# Altium schematic sheet BLOCK DIAGRAM.SchDoc: BLOCK DIAGRAM
size 420 x 297 mm; Date: March 14; CheckedBy: ThS. Bùi Quốc Bảo; DrawnBy: Nguyễn Gia Huy; Revision: V1.0; SheetNumber: 3; SheetTotal: 5; MasterProject: 2LEDs Dice game; Sub-system: 2LED_Dice.PrjPcb
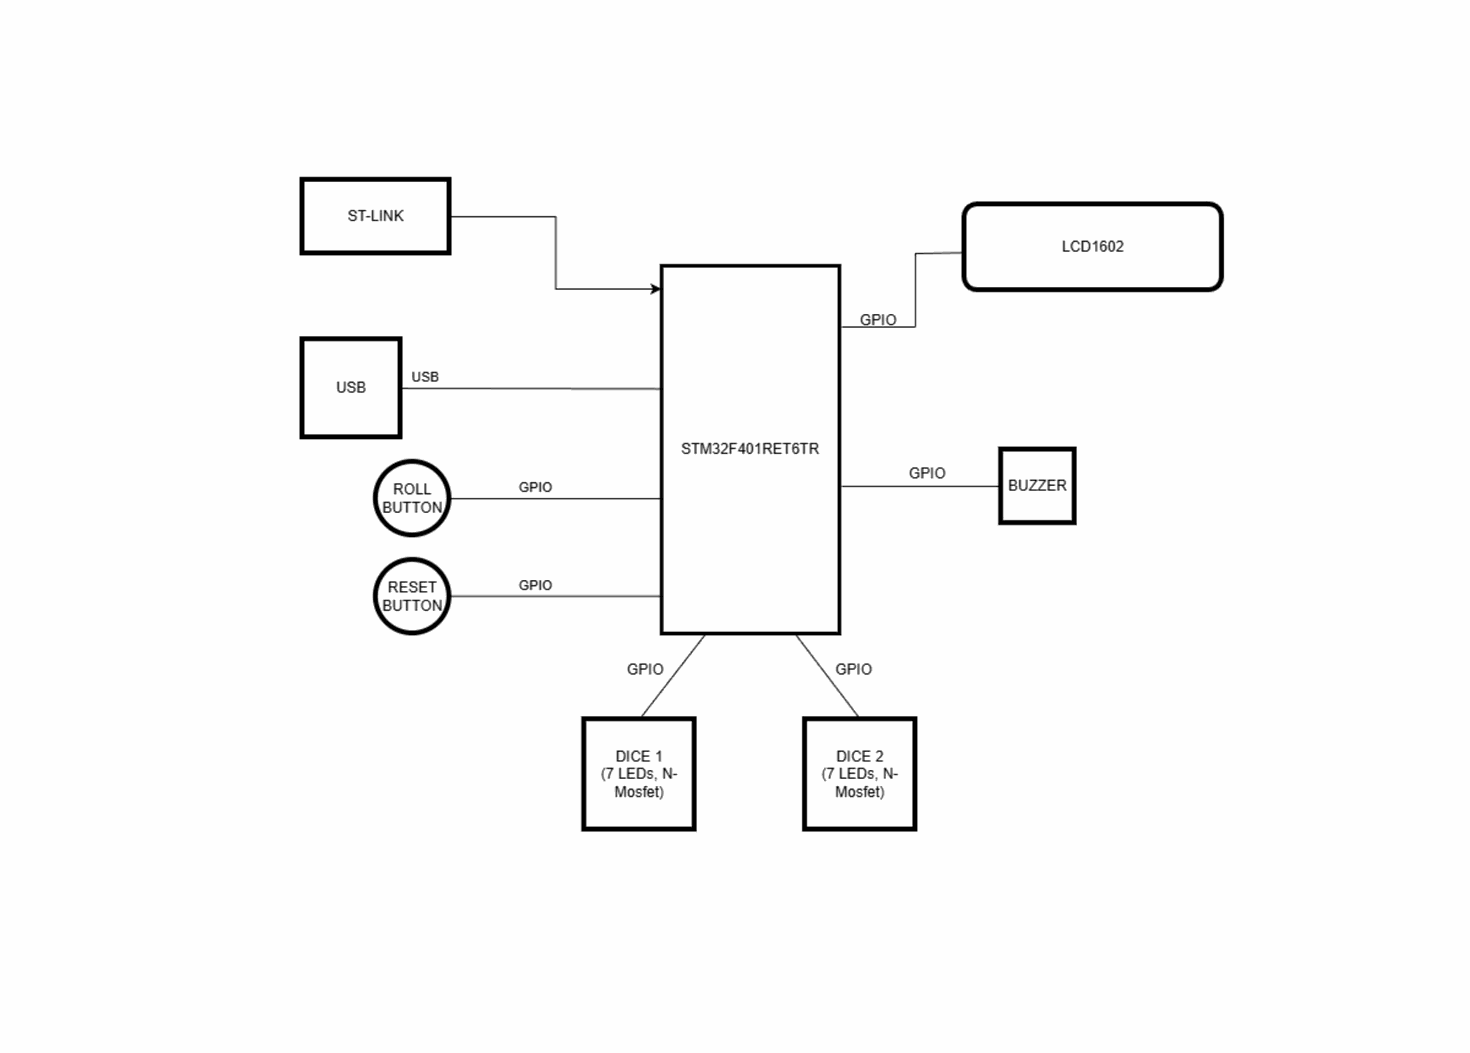
[diagram p0: BLOCK DIAGRAM.SchDoc]

## Notes on the sheet
- Sub-system:
- Project:
- Design by:
- Sheet title:
- Sheet
- of
- Checked by:
- Approved by:
- Doc No:
- Revision:
- Size:
- Dates:
- A3